# Altium schematic sheet Protoboard.SchDoc
size A
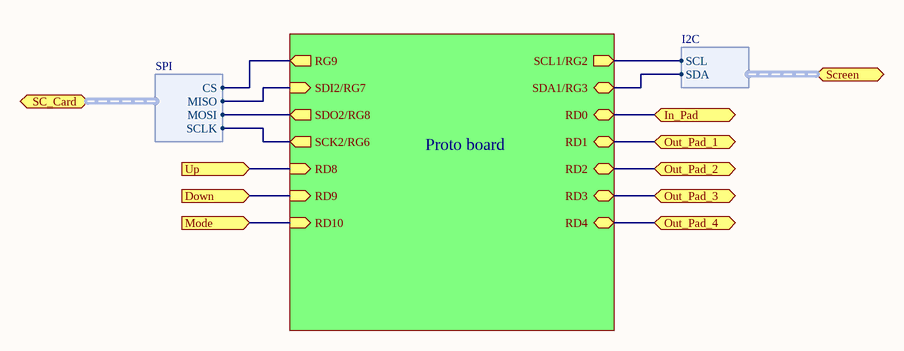
[diagram p0: Protoboard.SchDoc]

## Sub-sheets
Proto board = ?: SDI2/RG7 (in), SDO2/RG8 (out), SCK2/RG6 (out), RD8 (in), RD9 (in), RD10 (in), SCL1/RG2 (out), RD0, RD1, RD2, RD3, RD4, SDA1/RG3, RG9 (out)

## Ports
Down (in), In_Pad (bidir), Mode (in), Out_Pad_1 (bidir), Out_Pad_2 (bidir), Out_Pad_3 (bidir), Out_Pad_4 (bidir), SC_Card (harness SPI), Screen (harness I2C), Up (in)

## Harnesses
I2C: SCL, SDA
SPI: CS, MISO, MOSI, SCLK

## Nets
Down: port Down, sheet Proto board/RD9
In_Pad: port In_Pad, sheet Proto board/RD0
Mode: port Mode, sheet Proto board/RD10
Out_Pad_1: port Out_Pad_1, sheet Proto board/RD1
Out_Pad_2: port Out_Pad_2, sheet Proto board/RD2
Out_Pad_3: port Out_Pad_3, sheet Proto board/RD3
Out_Pad_4: port Out_Pad_4, sheet Proto board/RD4
Up: port Up, sheet Proto board/RD8
(unnamed): sheet Proto board/SDI2/RG7, port SC_Card.MISO
(unnamed): sheet Proto board/SDO2/RG8, port SC_Card.MOSI
(unnamed): sheet Proto board/SCK2/RG6, port SC_Card.SCLK
(unnamed): sheet Proto board/SCL1/RG2, port Screen.SCL
(unnamed): sheet Proto board/SDA1/RG3, port Screen.SDA
(unnamed): sheet Proto board/RG9, port SC_Card.CS